# Altium schematic sheet conexion.SchDoc
size A4
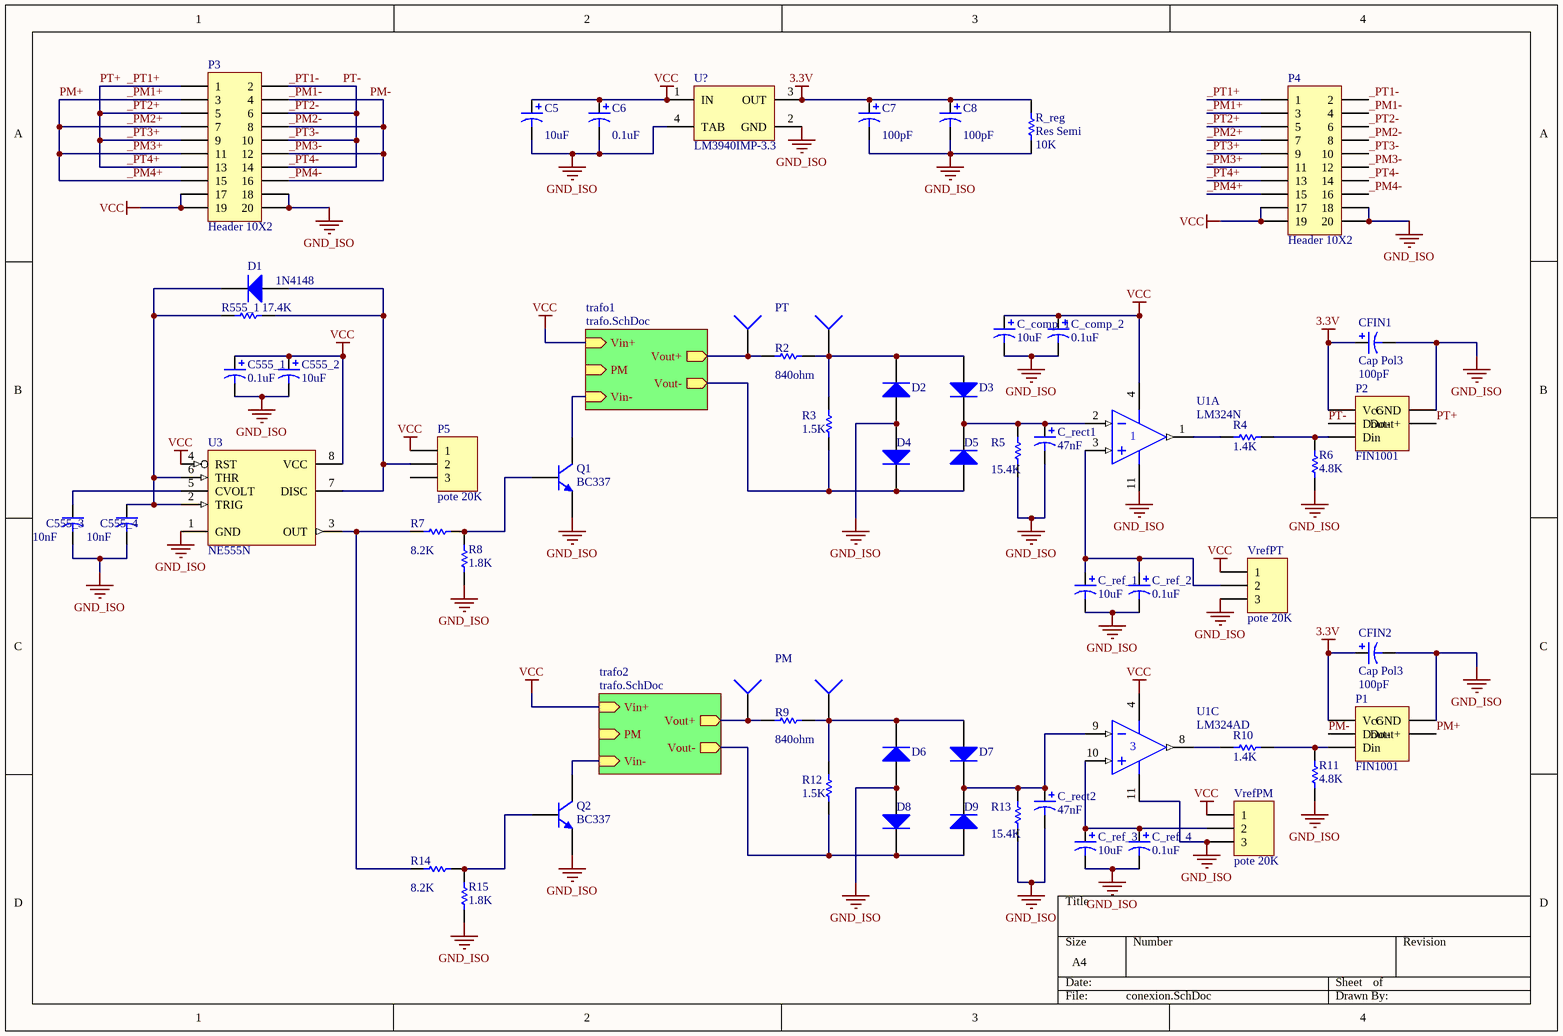
[diagram p0: conexion.SchDoc]

## Parts
(Parts that share a designator on the sheet are numbered #1, #2 ... from top to bottom, then left to right.)
C5  value 10uF  [CAPPR5-5x5]  (hidden comment: Cap Pol1)
C6  value 0.1uF  [C0805]  (hidden comment: Cap Pol3)
C7  value 100pF  [C0805]  (hidden comment: Cap Pol3)
C8  value 100pF  [CAPPR5-5x5]  (hidden comment: Cap Pol1)
C555_1  value 0.1uF  [C0805]  (hidden comment: Cap Pol3)
C555_2  value 10uF  [CAPPR5-5x5]  (hidden comment: Cap Pol1)
C555_3  value 10nF  [CAPR5-4X5]  (hidden comment: Cap2)
C555_4  value 10nF  [CAPR5-4X5]  (hidden comment: Cap2)
C_comp_1  value 10uF  [CAPPR5-5x5]  (hidden comment: Cap Pol1)
C_comp_2  value 0.1uF  [C0805]  (hidden comment: Cap Pol3)
C_rect1  value 47nF  [CAPPR5-5x5]  (hidden comment: Cap Pol1)
C_rect2  value 47nF  [CAPPR5-5x5]  (hidden comment: Cap Pol1)
C_ref_1  value 10uF  [CAPPR5-5x5]  (hidden comment: Cap Pol1)
C_ref_2  value 0.1uF  [CAPPR5-5x5]  (hidden comment: Cap Pol1)
C_ref_3  value 10uF  [CAPPR5-5x5]  (hidden comment: Cap Pol1)
C_ref_4  value 0.1uF  [CAPPR5-5x5]  (hidden comment: Cap Pol1)
CFIN1  Cap Pol3  value 100pF  [C0805]
CFIN2  Cap Pol3  value 100pF  [C0805]
D1  1N4148  [DO-41]
D2  1N4148  [DO-41]  (value not drawn)
D3  1N4148  [DO-41]  (value not drawn)
D4  1N4148  [DO-41]  (value not drawn)
D5  1N4148  [DO-41]  (value not drawn)
D6  1N4148  [DO-41]  (value not drawn)
D7  1N4148  [DO-41]  (value not drawn)
D8  1N4148  [DO-41]  (value not drawn)
D9  1N4148  [DO-41]  (value not drawn)
J1  PT  [PIN1]
J2  Socket  [PIN1]  (value not drawn)
J3  Socket  [PIN1]  (value not drawn)
J4  PM  [PIN1]
P1  FIN1001  [SOT23-5AM]
P2  FIN1001  [SOT23-5AM]
P3  Header 10X2  [HDR2X10]
P4  Header 10X2  [HDR2X10]
P5  pote 20K  [HDR1X3H]
Q1  BC337  [SOT54]
Q2  BC337  [SOT54]
R2  value 840ohm  [AXIAL-0.3]  (hidden comment: Res1)
R3  value 1.5K  [AXIAL-0.3]  (hidden comment: Res1)
R4  value 1.4K  [AXIAL-0.3]  (hidden comment: Res1)
R5  value 15.4K  [AXIAL-0.3]  (hidden comment: Res1)
R6  value 4.8K  [AXIAL-0.3]  (hidden comment: Res1)
R7  value 8.2K  [AXIAL-0.3]  (hidden comment: Res1)
R8  value 1.8K  [AXIAL-0.3]  (hidden comment: Res1)
R9  value 840ohm  [AXIAL-0.3]  (hidden comment: Res1)
R10  value 1.4K  [AXIAL-0.3]  (hidden comment: Res1)
R11  value 4.8K  [AXIAL-0.3]  (hidden comment: Res1)
R12  value 1.5K  [AXIAL-0.3]  (hidden comment: Res1)
R13  value 15.4K  [AXIAL-0.3]  (hidden comment: Res1)
R14  value 8.2K  [AXIAL-0.3]  (hidden comment: Res1)
R15  value 1.8K  [AXIAL-0.3]  (hidden comment: Res1)
R555_1  value 17.4K  [AXIAL-0.3]  (hidden comment: Res1)
R_reg  Res Semi  value 10K  [2012[0805]]
U1#1  LM324N  [646-06]  (part A of 4)
U1#2  LM324AD  [751A-03_L]  (part C of 4)
U3  NE555N  [DIP8]
U?  LM3940IMP-3.3  [MP04A_N]
VrefPM  pote 20K  [HDR1X3H]
VrefPT  pote 20K  [HDR1X3H]

## Sub-sheets
trafo1 = trafo.SchDoc: Vin+ (in), PM (in), Vin- (in), Vout+ (out), Vout- (out)
trafo2 = trafo.SchDoc: Vin+ (in), PM (in), Vin- (in), Vout+ (out), Vout- (out)

## Nets
3.3V: C7.1 C8.1 CFIN1.1 CFIN2.1 P1.1(Vcc) P2.1(Vcc) R_reg.2 U?.3(OUT)
GND_ISO: C5.2 C6.2 C7.2 C8.2 C555_1.2 C555_2.2 C555_3.2 C555_4.2 C_comp_1.2 C_comp_2.2 C_rect1.2 C_rect2.2 C_ref_1.2 C_ref_2.2 C_ref_3.2 C_ref_4.2 CFIN1.2 CFIN2.2 D2.1(A) D4.1(A) D6.1(A) D8.1(A) P1.2(GND) P2.2(GND) P3.18 P3.20 P4.18 P4.20 Q1.1(E) Q2.1(E) R5.1 R6.2 R8.1 R11.2 R13.1 R15.1 R_reg.1 U1#1.11(V-) U1#2.11(V-) U3.1(GND) U?.2(GND) U?.4(TAB) VrefPM.3 VrefPT.3
VCC: C5.1 C6.1 C555_1.1 C555_2.1 C_comp_1.1 C_comp_2.1 P3.17 P3.19 P4.17 P4.19 P5.1 U1#1.4(V+) U1#2.4(V+) U3.4(RST) U3.8(VCC) U?.1(IN) VrefPM.1 VrefPT.1 ; sheet trafo2/Vin+, sheet trafo1/Vin+
_PM1+: P1.4(Dout+) P3.3 P3.7 P3.11 P3.15 P4.3 P4.7 P4.11 P4.15  [also labelled _PM2+, _PM3+, _PM4+, PM+]
_PM1-: P1.3(Dout-) P3.4 P3.8 P3.12 P3.16 P4.4 P4.8 P4.12 P4.16  [also labelled _PM2-, _PM3-, _PM4-, PM-]
_PT1+: P2.4(Dout+) P3.1 P3.5 P3.9 P3.13 P4.1 P4.5 P4.9 P4.13  [also labelled _PT2+, _PT3+, _PT4+, PT+]
_PT1-: P2.3(Dout-) P3.2 P3.6 P3.10 P3.14 P4.2 P4.6 P4.10 P4.14  [also labelled _PT2-, _PT3-, _PT4-, PT-]
NetC555_3_1: C555_3.1 U3.5(CVOLT)
NetC555_4_1: C555_4.1 D1.2(K) R555_1.1 U3.2(TRIG) U3.6(THR)
NetC_rect1_1: C_rect1.1 D3.2(K) D5.2(K) R5.2 U1#1.2(IN1-)
NetC_rect2_1: C_rect2.1 D7.2(K) D9.2(K) R13.2 U1#2.9(IN3-)
NetC_ref_1_1: C_ref_1.1 C_ref_2.1 U1#1.3(IN1+) VrefPT.2
NetC_ref_3_1: C_ref_3.1 C_ref_4.1 U1#2.10(IN3+) VrefPM.2
NetD1_1: D1.1(A) P5.2 R555_1.2 U3.7(DISC)
NetD2_2: D2.2(K) D3.1(A) J1.1 R2.2 R3.2
NetD4_2: D4.2(K) D5.1(A) R3.1 ; sheet trafo1/Vout-
NetD6_2: D6.2(K) D7.1(A) J4.1 R9.2 R12.2
NetD8_2: D8.2(K) D9.1(A) R12.1 ; sheet trafo2/Vout-
NetJ2_1: J2.1 R2.1 ; sheet trafo1/Vout+
NetJ3_1: J3.1 R9.1 ; sheet trafo2/Vout+
NetP1_5: P1.5(Din) R10.1 R11.1
NetP2_5: P2.5(Din) R4.1 R6.1
NetQ1_2: Q1.2(B) R7.2 R8.2
NetQ1_3: Q1.3(C) ; sheet trafo1/Vin-
NetQ2_2: Q2.2(B) R14.2 R15.2
NetQ2_3: Q2.3(C) ; sheet trafo2/Vin-
NetR4_2: R4.2 U1#1.1(OUT1)
NetR7_1: R7.1 R14.1 U3.3(OUT)
NetR10_2: R10.2 U1#2.8(OUT3)

Not connected (* = marked no-connect by the designer): P5 3

## Library data of the parts
C5 C8 C555_2 C_comp_1 C_rect1 C_rect2 C_ref_1-C_ref_4 = Cap Pol1: Polarized Capacitor (Radial); Published: 8-Jun-2000; LatestRevisionDate: 17-Jul-2002; LatestRevisionNote: Re-released for DXP Platform.; PackageReference: RB7.6-15; Publisher: Altium Limited
C6 C7 C555_1 C_comp_2 CFIN1 CFIN2 = Cap Pol3: Polarized Capacitor (Surface Mount); Published: 8-Jun-2000; LatestRevisionDate: 17-Jul-2002; LatestRevisionNote: Re-released for DXP Platform.; PackageReference: C0805; Publisher: Altium Limited
C555_3 C555_4 = Cap2: Capacitor; Published: 23-Sep-2002; PackageReference: CAPR5-4X5; Publisher: Altium Limited
D1-D9 = Diode 1N4001: 1 Amp General Purpose Rectifier; Published: 8-Jun-2000; LatestRevisionDate: 17-Jul-2002; LatestRevisionNote: Re-released for DXP Platform.; DatasheetDocument: 1998; PackageDocument: Aug-1999; PackageReference: DO-41; Publisher: Altium Limited; Code_JEDEC: DO-204-AL; ComponentLink1Description: Manufacturer Link; ComponentLink1URL: http://www.fairchildsemi.com/; ComponentLink2Description: Datasheet; ComponentLink2URL: http://www.fairchildsemi.com/ds/1N%2F1N4001.pdf
J1 J4 = Socket: LatestRevisionDate: 17-Jul-2002; LatestRevisionNote: Re-released for DXP Platform.; Publisher: Altium Limited
P1 P2 = Header 3X2: Header, 3-Pin, Dual row; LatestRevisionDate: 17-Jul-2002; LatestRevisionNote: Re-released for DXP Platform.; Publisher: Altium Limited
P3 P4 = Header 10X2: Header, 10-Pin, Dual row; LatestRevisionDate: 17-Jul-2002; LatestRevisionNote: Re-released for DXP Platform.; Publisher: Altium Limited
P5 VrefPM VrefPT = Header 3H: Header, 3-Pin, Right Angle; LatestRevisionDate: 17-Jul-2002; LatestRevisionNote: Re-released for DXP Platform.; Publisher: Altium Limited
Q1 Q2 = BC337: NPN General-purpose Transistor; Published: 17-Sep-2003; LatestRevisionDate: 12-Dec-2006; LatestRevisionNote: Footprint pad sequence fixed.; DatasheetVersion: 15-Apr-1999; PackageVersion: Feb-1997; PackageReference: SOT54; Publisher: Altium Limited; PackageDescription: Plastic Single-Ended Leaded (through hole) package; 3 Leads (TO-92); Code_JEITA: SC-43; Code_JEDEC: TO-92; ComponentLink1Description: Manufacturer Link; ComponentLink1URL: http://www.semiconductors.philips.com/; ComponentLink2Description: Datasheet; ComponentLink2URL: http://www.semiconductors.philips.com/acrobat/datasheets/BC817_BC817W_BC337_5.pdf
R2-R15 R555_1 = Res1: Resistor; Published: 8-Jun-2000; LatestRevisionDate: 17-Jul-2002; LatestRevisionNote: Re-released for DXP Platform.; PackageReference: AXIAL-0.3; Publisher: Altium Limited
R_reg = Res Semi: Semiconductor Resistor; Published: 8-Jun-2000; LatestRevisionDate: 17-Jul-2002; LatestRevisionNote: Re-released for DXP Platform.; PackageReference: AXIAL-0.5; Publisher: Altium Limited
U1#1 = LM324N: Quad Differential Input, Low-Power Operational Amplifier; Published: 28-Feb-2003; DatasheetVersion: Dec-2001, Rev. 7; PackageVersion: 1995; PackageReference: 646-06; Publisher: Altium Limited; PackageDescription: DIP; 14 Leads; Row Spacing 7.62 mm; Pitch 2.54 mm; ComponentLink1Description: Manufacturer Link; ComponentLink1URL: http://www.onsemi.com/; ComponentLink2Description: Datasheet; ComponentLink2URL: http://www.onsemi.com/pub/Collateral/LM324-D.PDF
U1#2 = LM324AD: Quad Differential Input, Low-Power Operational Amplifier; Published: 28-Feb-2003; LatestRevisionDate: 13-Apr-2006; LatestRevisionNote: IPC-7351 Footprint Added.; DatasheetVersion: Dec-2001, Rev. 7; PackageReference: 751A-03; Publisher: Altium Limited; PackageDescription: 14-Pin Small Outline Integrated Circuit 1.27 mm Pitch; Code_JEDEC: MS-012-AB; Code_IPC: SOIC127P600-14; ComponentLink1Description: Manufacturer Link; ComponentLink1URL: http://www.onsemi.com/; ComponentLink2Description: Datasheet; ComponentLink2URL: http://www.onsemi.com/pub/Collateral/LM324-D.PDF
U3 = NE555N: General-Purpose Single Bipolar Timer; Published: 24-Aug-2001; LatestRevisionDate: 06-Jun-2005; LatestRevisionNote: Stylized 3D Model Added.; DatasheetVersion: Jul-1998; PackageReference: DIP8; Publisher: Altium Limited; PackageDescription: DIP; 8 Leads; Row Spacing 7.62 mm; Pitch 2.54 mm; Code_JEDEC: MO-001-AN; ComponentLink1Description: Manufacturer Link; ComponentLink1URL: http://www.st.com/; ComponentLink2Description: Datasheet; ComponentLink2URL: http://www.st.com/stonline/products/literature/ds/2182/ne555.pdf
U? = LM3940IMP-3.3: 1A Low Dropout Regulator for 5V to 3.3V Conversion; Manufacturer: National Semiconductor; CompType: LDO IC; PackageTopMarking: XYTT*L52B; Published: 27-Nov-2008; DatasheetVersion: Jul-2007; PackageVersion: revB, Apr-2003; PackageReference: MP04A; Publisher: Altium Limited; PackageDescription: Molded SOT-223, 6.50 x 3.56 x 1.6mm Body, 4 Lead, 2.3mm Pitch; PartNumber: LM3940IMP-3.3; RoHS: O; PinCount: 4; DigiKeyPartNumber: LM3940IMP-3.3CT-ND; Code_JEDEC: TO-261-AA; Code_IPC: SOT223-4; ComponentLink1Description: LM3940 Datasheet; ComponentLink1URL: http://www.national.com/ds/LM/LM3940.pdf; ComponentLink2Description: LM3940 Web Page; ComponentLink2URL: http://www.national.com/pf/LM/LM3940.html; ComponentLink3Description: MP04A Package Page; ComponentLink3URL: http://www.national.com/packaging/folders/mp04a.html
J2 J3 = Socket: LatestRevisionDate: 17-Jul-2002; LatestRevisionNote: Re-released for DXP Platform.; Publisher: Altium Limited